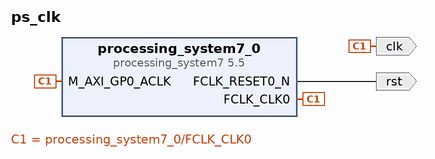
[diagram p0: block diagram of the top level]
# Vivado block design ps_clk, Vivado 2015.4
create_bd_design ps_clk

create_bd_port -dir O -type clk clk
create_bd_port -dir O -type rst rst

create_bd_cell -type ip -vlnv xilinx.com:ip:processing_system7:5.5 processing_system7_0
set_property -dict {CONFIG.PCW_FPGA0_PERIPHERAL_FREQMHZ 50} [get_bd_cells processing_system7_0]

# ---- connections ----

connect_bd_net [get_bd_pins processing_system7_0/FCLK_CLK0] [get_bd_ports clk] [get_bd_pins processing_system7_0/M_AXI_GP0_ACLK]
connect_bd_net [get_bd_pins processing_system7_0/FCLK_RESET0_N] [get_bd_ports rst]

validate_bd_design
save_bd_design
